# Altium schematic sheet Top.SchDoc
size A4; SheetNumber: 1; SheetTotal: 6
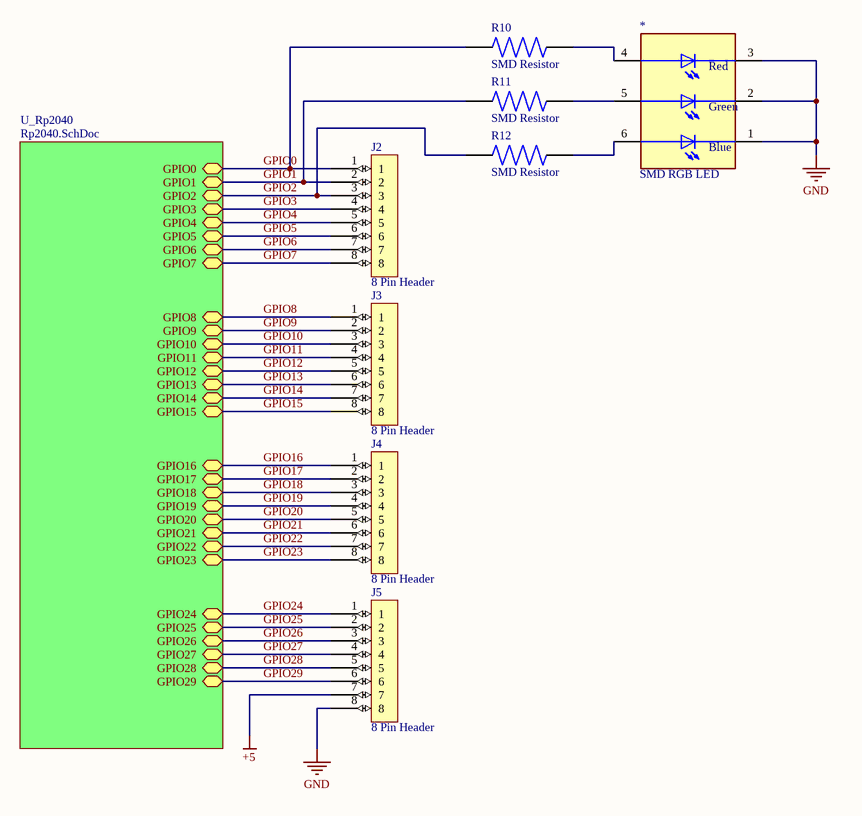
[diagram p0: Top.SchDoc]

## Parts
*  SMD RGB LED  [SMD RGB LED-Footprint-1]
J2  8 Pin Header  [8 Pin Header-Footprint-1]
J3  8 Pin Header  [8 Pin Header-Footprint-1]
J4  8 Pin Header  [8 Pin Header-Footprint-1]
J5  8 Pin Header  [8 Pin Header-Footprint-1]
R10  SMD Resistor  [SMD Resistor-Footprint-1]
R11  SMD Resistor  [SMD Resistor-Footprint-1]
R12  SMD Resistor  [SMD Resistor-Footprint-1]

## Sub-sheets
U_Rp2040 = Rp2040.SchDoc: GPIO0 (bidir), GPIO1 (bidir), GPIO2 (bidir), GPIO3 (bidir), GPIO4 (bidir), GPIO5 (bidir), GPIO6 (bidir), GPIO7 (bidir), GPIO8 (bidir), GPIO9 (bidir), GPIO10 (bidir), GPIO11 (bidir), GPIO12 (bidir), GPIO13 (bidir), GPIO14 (bidir), GPIO15 (bidir), GPIO16 (bidir), GPIO17 (bidir), GPIO18 (bidir), GPIO19 (bidir), GPIO20 (bidir), GPIO21 (bidir), GPIO22 (bidir), GPIO23 (bidir), GPIO24 (bidir), GPIO25 (bidir), GPIO26 (bidir), GPIO27 (bidir), GPIO28 (bidir), GPIO29 (bidir)

## Nets
+5: J5.7
GND: *.1 *.2 *.3 J5.8
GPIO0: J2.1 R10.1 ; sheet U_Rp2040/GPIO0
GPIO1: J2.2 R11.1 ; sheet U_Rp2040/GPIO1
GPIO2: J2.3 R12.1 ; sheet U_Rp2040/GPIO2
GPIO3: J2.4 ; sheet U_Rp2040/GPIO3
GPIO4: J2.5 ; sheet U_Rp2040/GPIO4
GPIO5: J2.6 ; sheet U_Rp2040/GPIO5
GPIO6: J2.7 ; sheet U_Rp2040/GPIO6
GPIO7: J2.8 ; sheet U_Rp2040/GPIO7
GPIO8: J3.1 ; sheet U_Rp2040/GPIO8
GPIO9: J3.2 ; sheet U_Rp2040/GPIO9
GPIO10: J3.3 ; sheet U_Rp2040/GPIO10
GPIO11: J3.4 ; sheet U_Rp2040/GPIO11
GPIO12: J3.5 ; sheet U_Rp2040/GPIO12
GPIO13: J3.6 ; sheet U_Rp2040/GPIO13
GPIO14: J3.7 ; sheet U_Rp2040/GPIO14
GPIO15: J3.8 ; sheet U_Rp2040/GPIO15
GPIO16: J4.1 ; sheet U_Rp2040/GPIO16
GPIO17: J4.2 ; sheet U_Rp2040/GPIO17
GPIO18: J4.3 ; sheet U_Rp2040/GPIO18
GPIO19: J4.4 ; sheet U_Rp2040/GPIO19
GPIO20: J4.5 ; sheet U_Rp2040/GPIO20
GPIO21: J4.6 ; sheet U_Rp2040/GPIO21
GPIO22: J4.7 ; sheet U_Rp2040/GPIO22
GPIO23: J4.8 ; sheet U_Rp2040/GPIO23
GPIO24: J5.1 ; sheet U_Rp2040/GPIO24
GPIO25: J5.2 ; sheet U_Rp2040/GPIO25
GPIO26: J5.3 ; sheet U_Rp2040/GPIO26
GPIO27: J5.4 ; sheet U_Rp2040/GPIO27
GPIO28: J5.5 ; sheet U_Rp2040/GPIO28
GPIO29: J5.6 ; sheet U_Rp2040/GPIO29
Net*_4: *.4 R10.2
Net*_5: *.5 R11.2
Net*_6: *.6 R12.2

## Notes on the sheet
- (in symbol CMP-00015-1) Red; Green; Blue

## Library data of the parts
* = CMP-00015-1
J2-J5 = CMP-00039-2: 8 Pin Breakout Header
R10-R12 = CMP-00019-4: Generic SMD Resistor